# EAGLE design B+ to VM Protection Circuit (EAGLE 6.3)

## Sheet 1 of 5
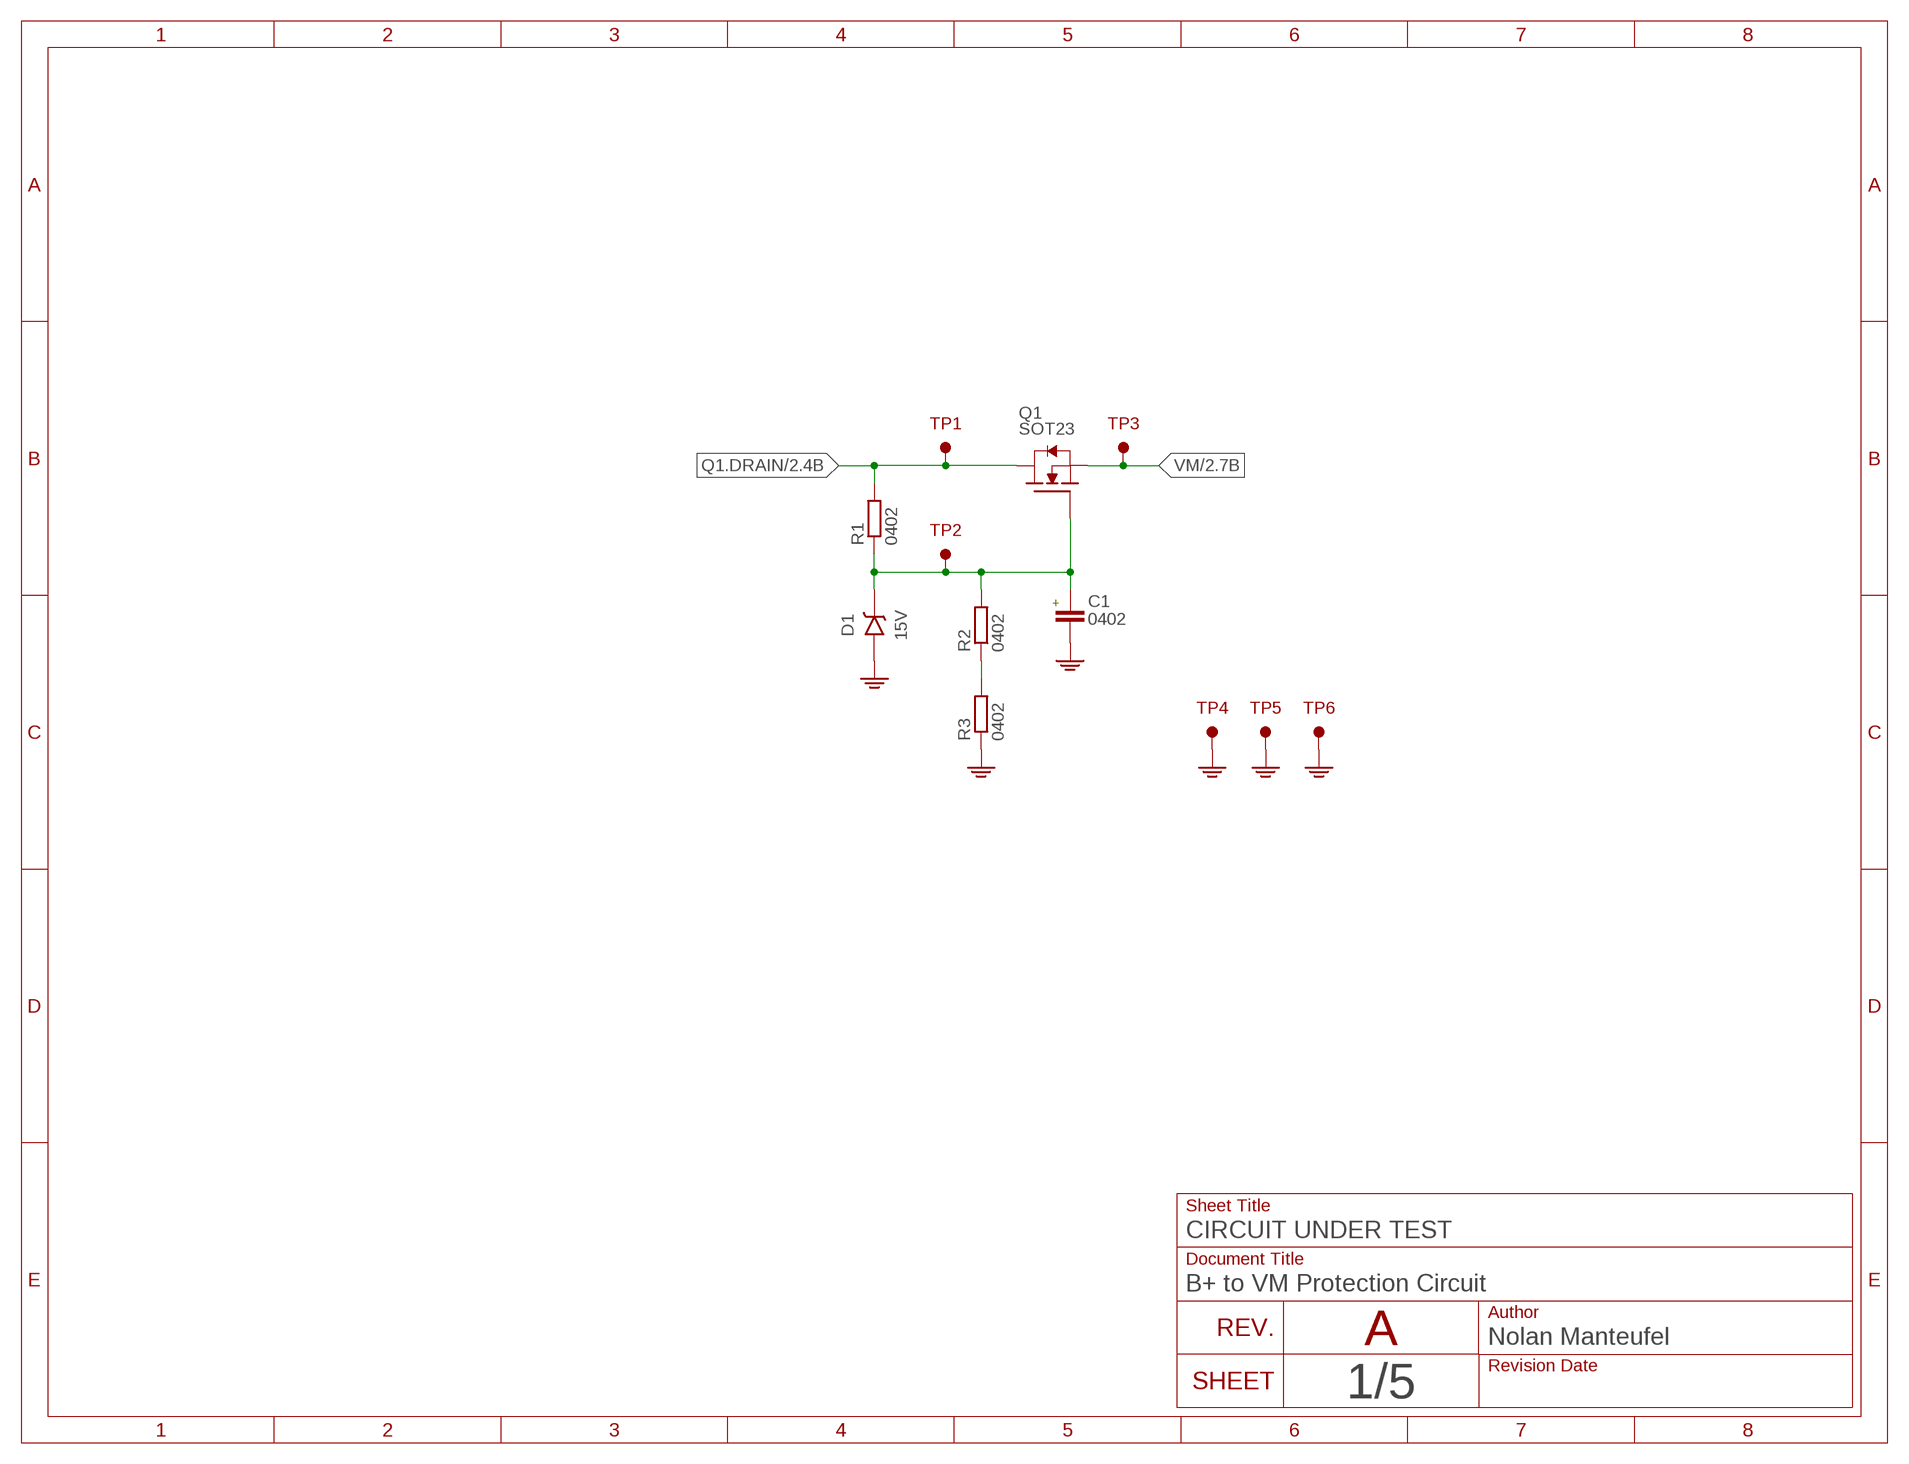
[diagram p0: schematic, sheet 1]

### Parts
C1  0402  C-EUC0402  [C0402]
D1  15V  ZENER-DIODESOT23  [SOT23]
Q1  SOT23  MOSFET-NSOT23  [SOT23]
R1  0402  R-EU_R0402  [R0402]
R2  0402  R-EU_R0402  [R0402]
R3  0402  R-EU_R0402  [R0402]
TP1  TESTPOINTKE5000-SMTEXT  [PINS_1_TESTPOINT_KE5000_NOTEXT]
TP2  TESTPOINTKE5000-SMTEXT  [PINS_1_TESTPOINT_KE5000_NOTEXT]
TP3  TESTPOINTKE5000-SMTEXT  [PINS_1_TESTPOINT_KE5000_NOTEXT]
TP4  TESTPOINTKE5000-SMTEXT  [PINS_1_TESTPOINT_KE5000_NOTEXT]
TP5  TESTPOINTKE5000-SMTEXT  [PINS_1_TESTPOINT_KE5000_NOTEXT]
TP6  TESTPOINTKE5000-SMTEXT  [PINS_1_TESTPOINT_KE5000_NOTEXT]

### Nets
GND: C1.2 D1.1(A) R3.1 TP4.1 TP5.1 TP6.1 ; also sheet 2,3,4,5
N$4: R2.1 R3.2
Q1.DRAIN: Q1.3(D) R1.2 TP1.1 ; also sheet 2
Q1.GATE: C1.1 D1.3(C) Q1.1(G) R1.1 R2.2 TP2.1
VM: Q1.2(S) TP3.1 ; also sheet 2,3

### Notes on the sheet
- A

## Sheet 2 of 5
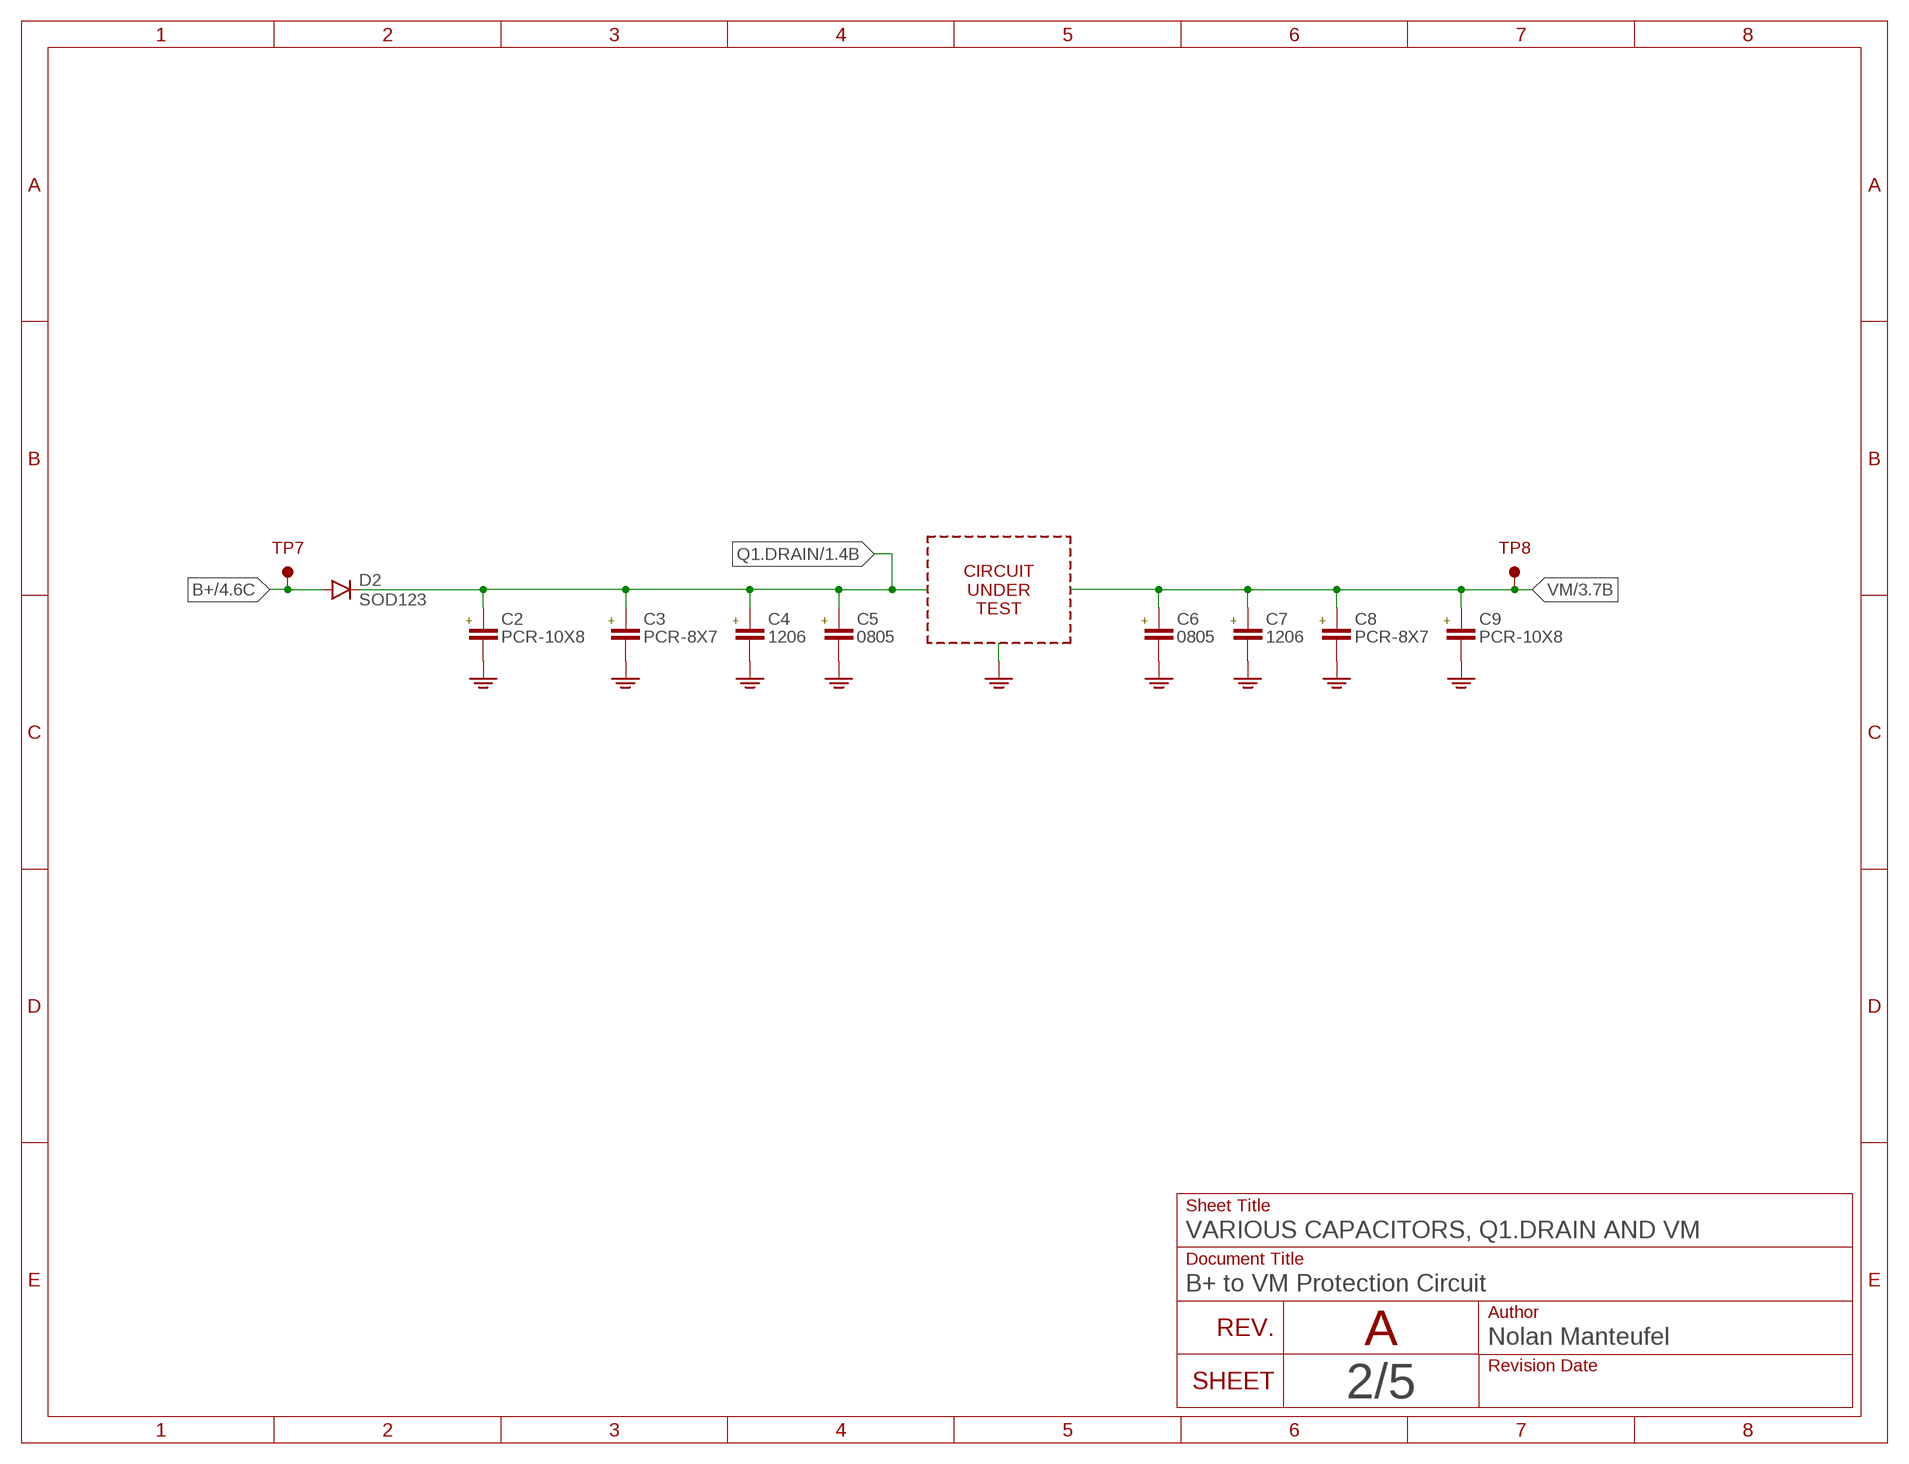
[diagram p1: schematic, sheet 2]

### Parts
C2  PCR-10X8  C-EUPCR-10X8  [C-PCR-10X8]
C3  PCR-8X7  C-EUPCR-8X7  [C-PCR-8X7]
C4  1206  C-EUC1206  [C1206]
C5  0805  C-EUC0805  [C0805]
C6  0805  C-EUC0805  [C0805]
C7  1206  C-EUC1206  [C1206]
C8  PCR-8X7  C-EUPCR-8X7  [C-PCR-8X7]
C9  PCR-10X8  C-EUPCR-10X8  [C-PCR-10X8]
D2  SOD123  DIODE-SOD123  [SOD123]
TP7  TESTPOINTKE5000-SMTEXT  [PINS_1_TESTPOINT_KE5000_NOTEXT]
TP8  TESTPOINTKE5000-SMTEXT  [PINS_1_TESTPOINT_KE5000_NOTEXT]

### Nets
B+: D2.A TP7.1 ; also sheet 4
GND: C2.- C3.- C4.- C5.2 C6.2 C7.- C8.- C9.- ; also sheet 1,3,4,5
Q1.DRAIN: C2.+ C3.+ C4.+ C5.1 D2.C ; also sheet 1
VM: C6.1 C7.+ C8.+ C9.+ TP8.1 ; also sheet 1,3

### Notes on the sheet
- CIRCUIT
  UNDER
  TEST
- A

## Sheet 3 of 5
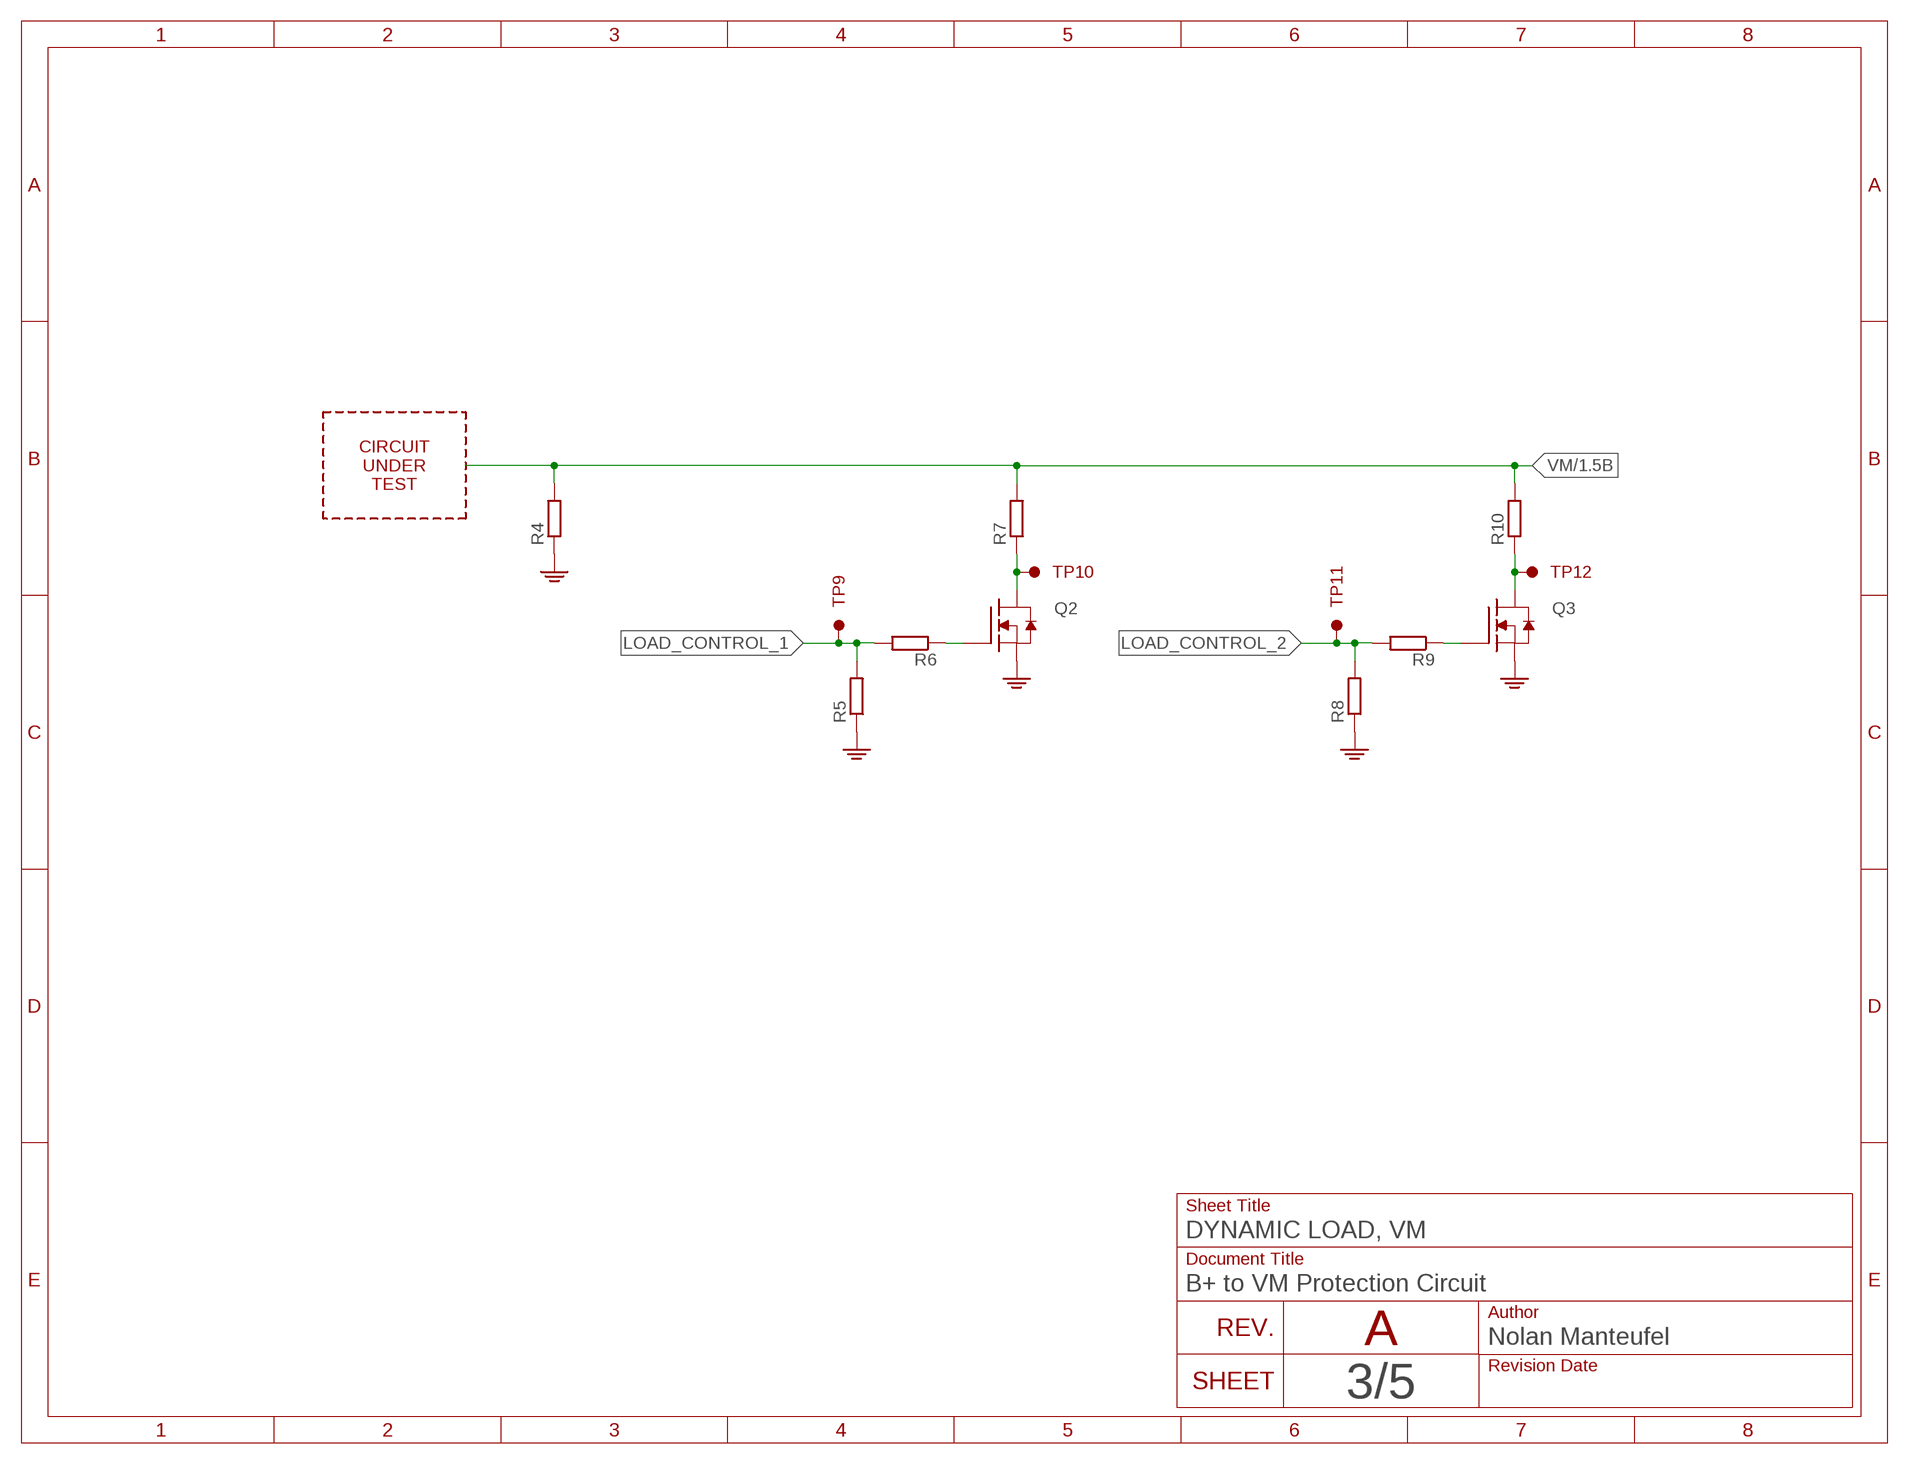
[diagram p2: schematic, sheet 3]

### Parts
Q2  MOSFET-N_NTMFS5C426NT3G  [DFN5]
Q3  MOSFET-N_NTMFS5C426NT3G  [DFN5]
R4  R-EU_0207/10  [0207/10]
R5  R-EU_M0805  [M0805]
R6  R-EU_M0805  [M0805]
R7  R-EU_0207/10  [0207/10]
R8  R-EU_M0805  [M0805]
R9  R-EU_M0805  [M0805]
R10  R-EU_0207/10  [0207/10]
TP9  TESTPOINTKE5000-SMTEXT  [PINS_1_TESTPOINT_KE5000_NOTEXT]
TP10  TESTPOINTKE5000-SMTEXT  [PINS_1_TESTPOINT_KE5000_NOTEXT]
TP11  TESTPOINTKE5000-SMTEXT  [PINS_1_TESTPOINT_KE5000_NOTEXT]
TP12  TESTPOINTKE5000-SMTEXT  [PINS_1_TESTPOINT_KE5000_NOTEXT]

### Nets
GND: Q2.1(S) Q2.2(S) Q2.3(S) Q3.1(S) Q3.2(S) Q3.3(S) R4.1 R5.1 R8.1 ; also sheet 1,2,4,5
LOAD_CONTROL_1: R5.2 R6.2 TP9.1
LOAD_CONTROL_2: R8.2 R9.2 TP11.1
N$2: Q2.5(D) R7.1 TP10.1
N$3: Q3.5(D) R10.1 TP12.1
N$5: Q3.4(G) R9.1
N$6: Q2.4(G) R6.1
VM: R4.2 R7.2 R10.2 ; also sheet 1,2

### Notes on the sheet
- CIRCUIT
  UNDER
  TEST
- A

## Sheet 4 of 5
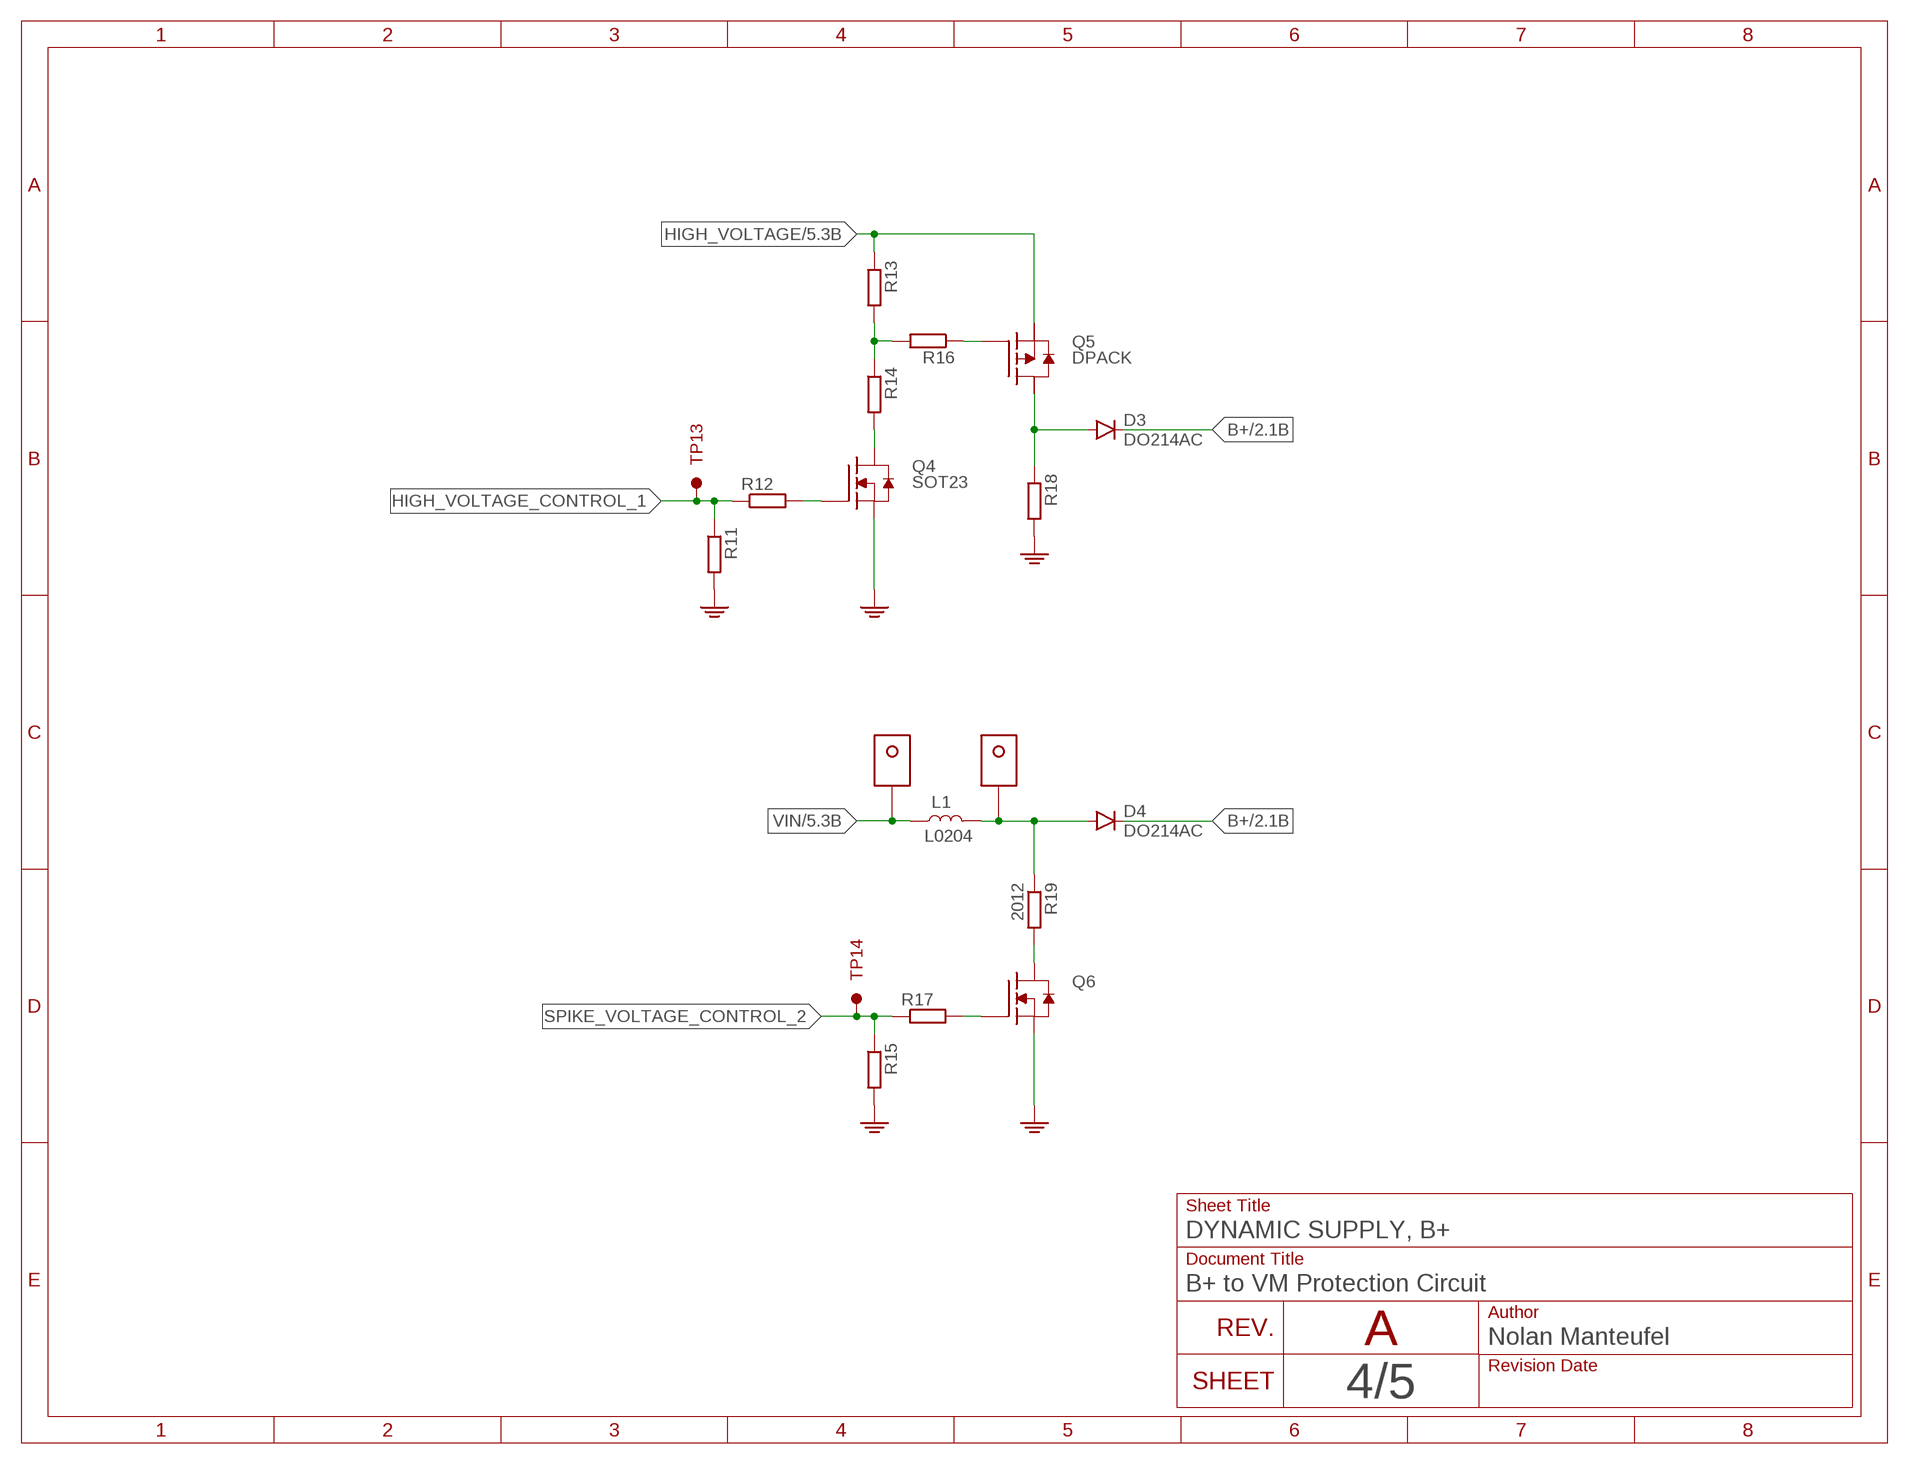
[diagram p3: schematic, sheet 4]

### Parts
D3  DO214AC  DIODE-DO214AC  [DO214AC]
D4  DO214AC  DIODE-DO214AC  [DO214AC]
L1  L0204  [0204/5]
Q4  SOT23  MOSFET-NSOT23  [SOT23]
Q5  DPACK  MOSFET-PDPAK  [D-PAK_TO252AA]
Q6  MOSFET-N_NTMFS5C426NT3G  [DFN5]
R11  R-EU_M0805  [M0805]
R12  R-EU_M0805  [M0805]
R13  R-EU_M0805  [M0805]
R14  R-EU_M0805  [M0805]
R15  R-EU_M0805  [M0805]
R16  R-EU_M0805  [M0805]
R17  R-EU_M0805  [M0805]
R18  R-EU_M0805  [M0805]
R19  2012  R-EU_R1210  [R1210]
TP13  TESTPOINTKE5000-SMTEXT  [PINS_1_TESTPOINT_KE5000_NOTEXT]
TP14  TESTPOINTKE5000-SMTEXT  [PINS_1_TESTPOINT_KE5000_NOTEXT]
U$1  SPADE-TAB  [SPADE-TAB-6.3MM]
U$2  SPADE-TAB  [SPADE-TAB-6.3MM]

### Nets
B+: D3.C D4.C ; also sheet 2
GND: Q4.2(S) Q6.1(S) Q6.2(S) Q6.3(S) R11.2 R15.2 R18.2 ; also sheet 1,2,3,5
HIGH_VOLTAGE: Q5.4(S) R13.1 ; also sheet 5
HIGH_VOLTAGE_CONTROL_1: R11.1 R12.1 TP13.1
N$7: R13.2 R14.1 R16.2
N$8: Q4.1(G) R12.2
N$9: Q4.3(D) R14.2
N$10: D3.A Q5.3(D) R18.1
N$11: Q6.4(G) R17.2
N$12: D4.A L1.2 R19.1 U$2.P$1 U$2.P$2
N$13: Q5.1(G) R16.1
N$14: Q6.5(D) R19.2
SPIKE_VOLTAGE_CONTROL_2: R15.1 R17.1 TP14.1
VIN: L1.1 U$1.P$1 U$1.P$2 ; also sheet 5

### Notes on the sheet
- A

## Sheet 5 of 5
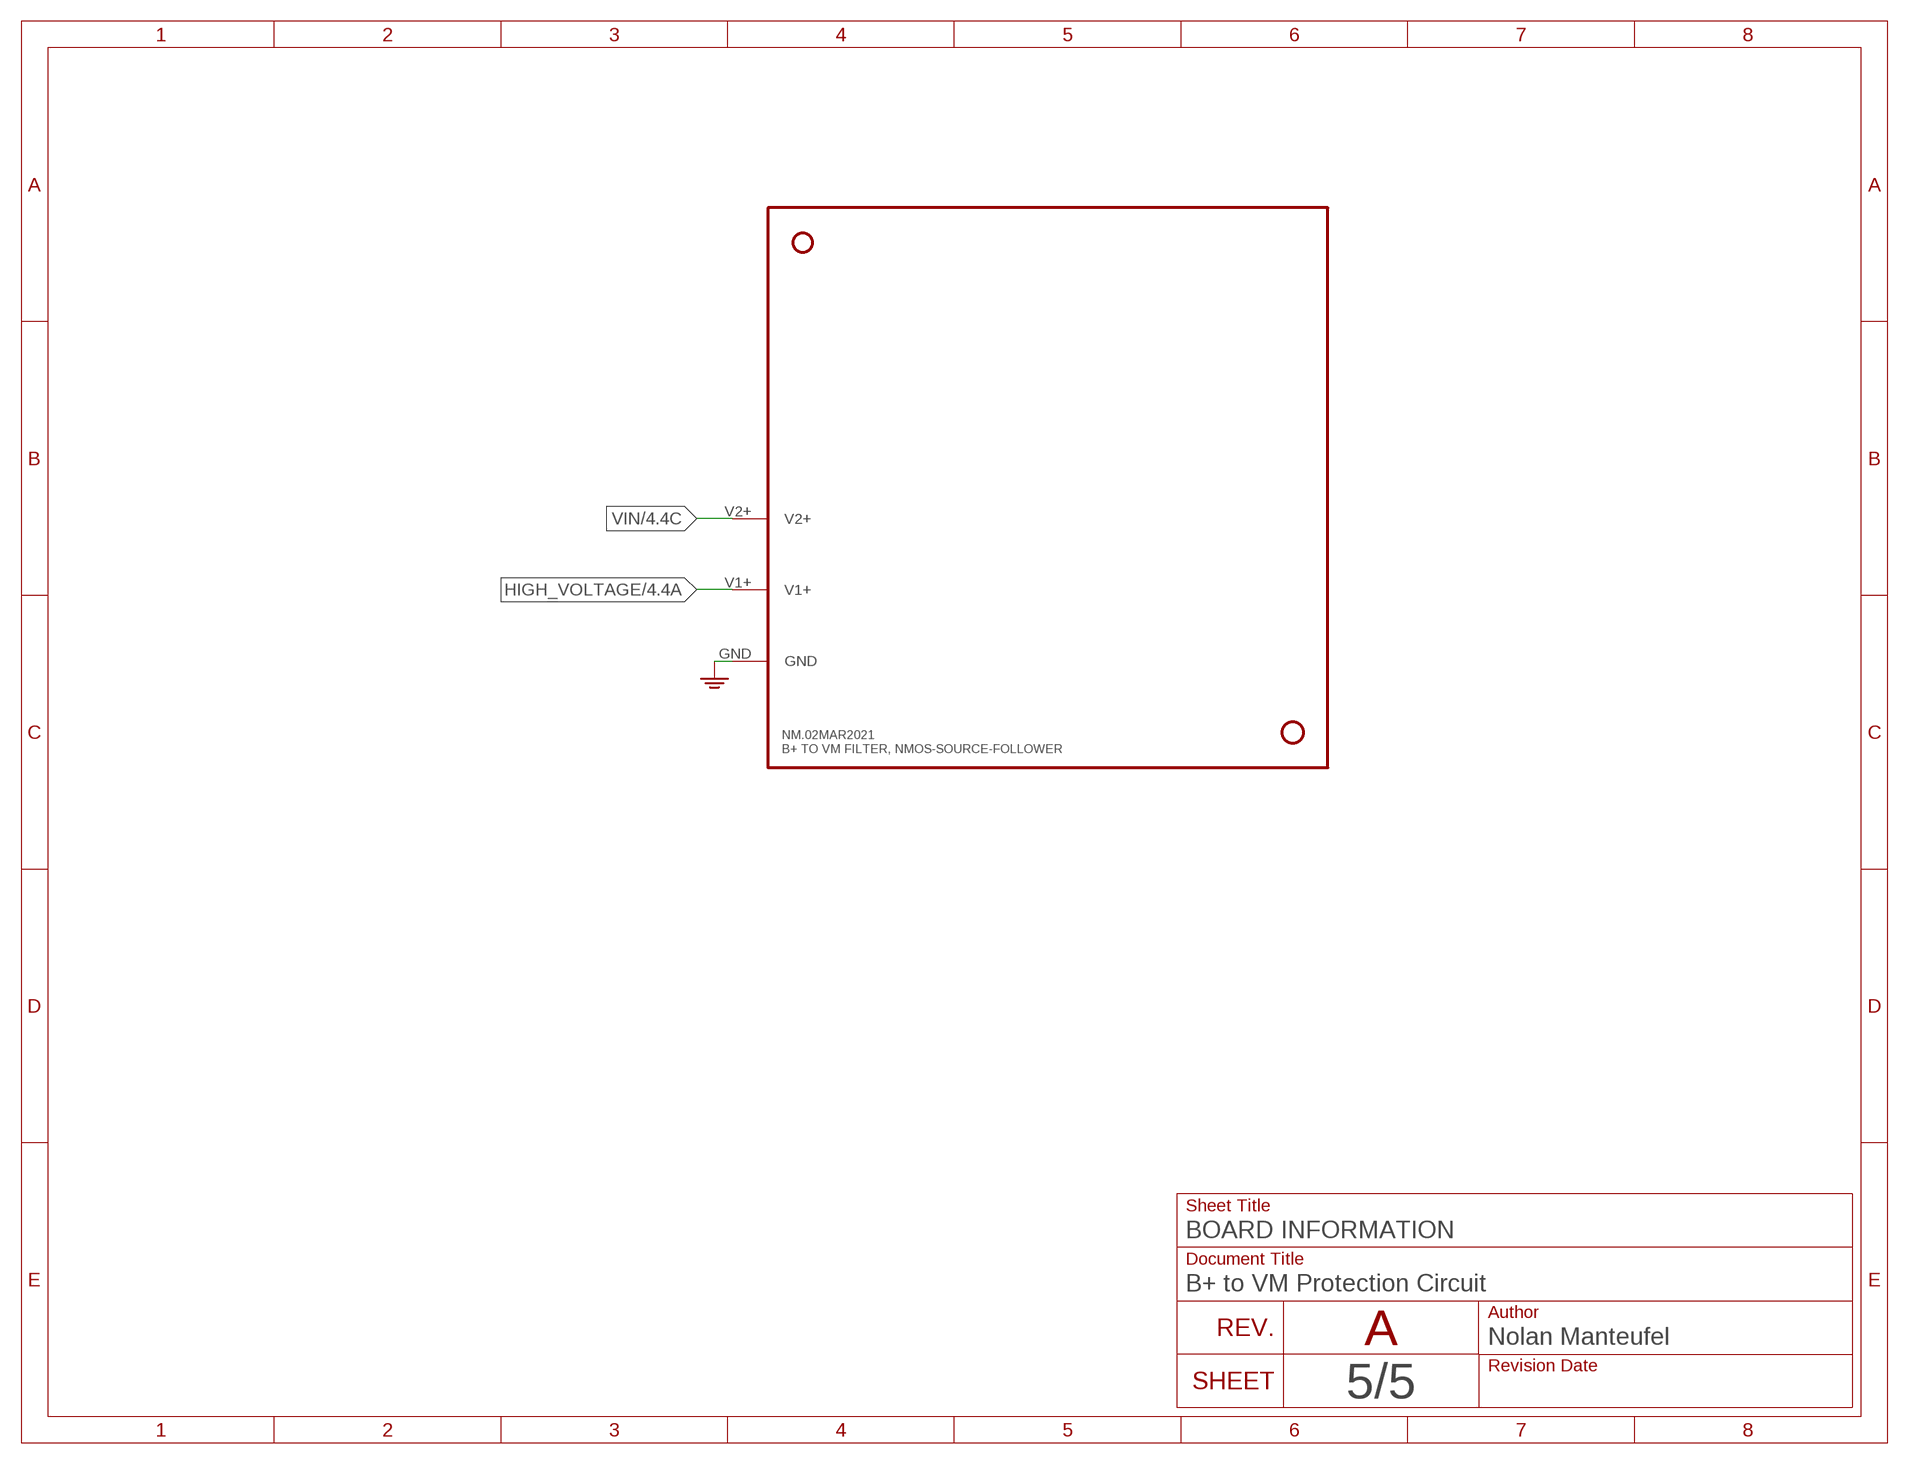
[diagram p4: schematic, sheet 5]

### Parts
NM.02MAR2021  B+ TO VM FILTER, NMOS-SOURCE-FOLLOWER  PCB_EVAL_80X80  [EVAL-80X80]

### Nets
GND: NM.02MAR2021.GND ; also sheet 1,2,3,4
HIGH_VOLTAGE: NM.02MAR2021.V1+ ; also sheet 4
VIN: NM.02MAR2021.V2+ ; also sheet 4

### Notes on the sheet
- A

## Library data of the parts
C1-C9 = nolan:C-EU: CAPACITOR, European symbol
D1 = nolan:ZENER-DIODE: Z-Diode
D2-D4 = nolan:DIODE-: DIODE
L1 = nolan:L
NM.02MAR2021 = nolan:PCB_EVAL_80X80
Q1-Q4 Q6 = nolan:MOSFET-N
Q5 = nolan:MOSFET-P
R1-R19 = nolan:R-EU_: RESISTOR, European symbol
TP1-TP14 = nolan:TESTPOINT
U$1 U$2 = nolan:SPADE-TAB

## Board
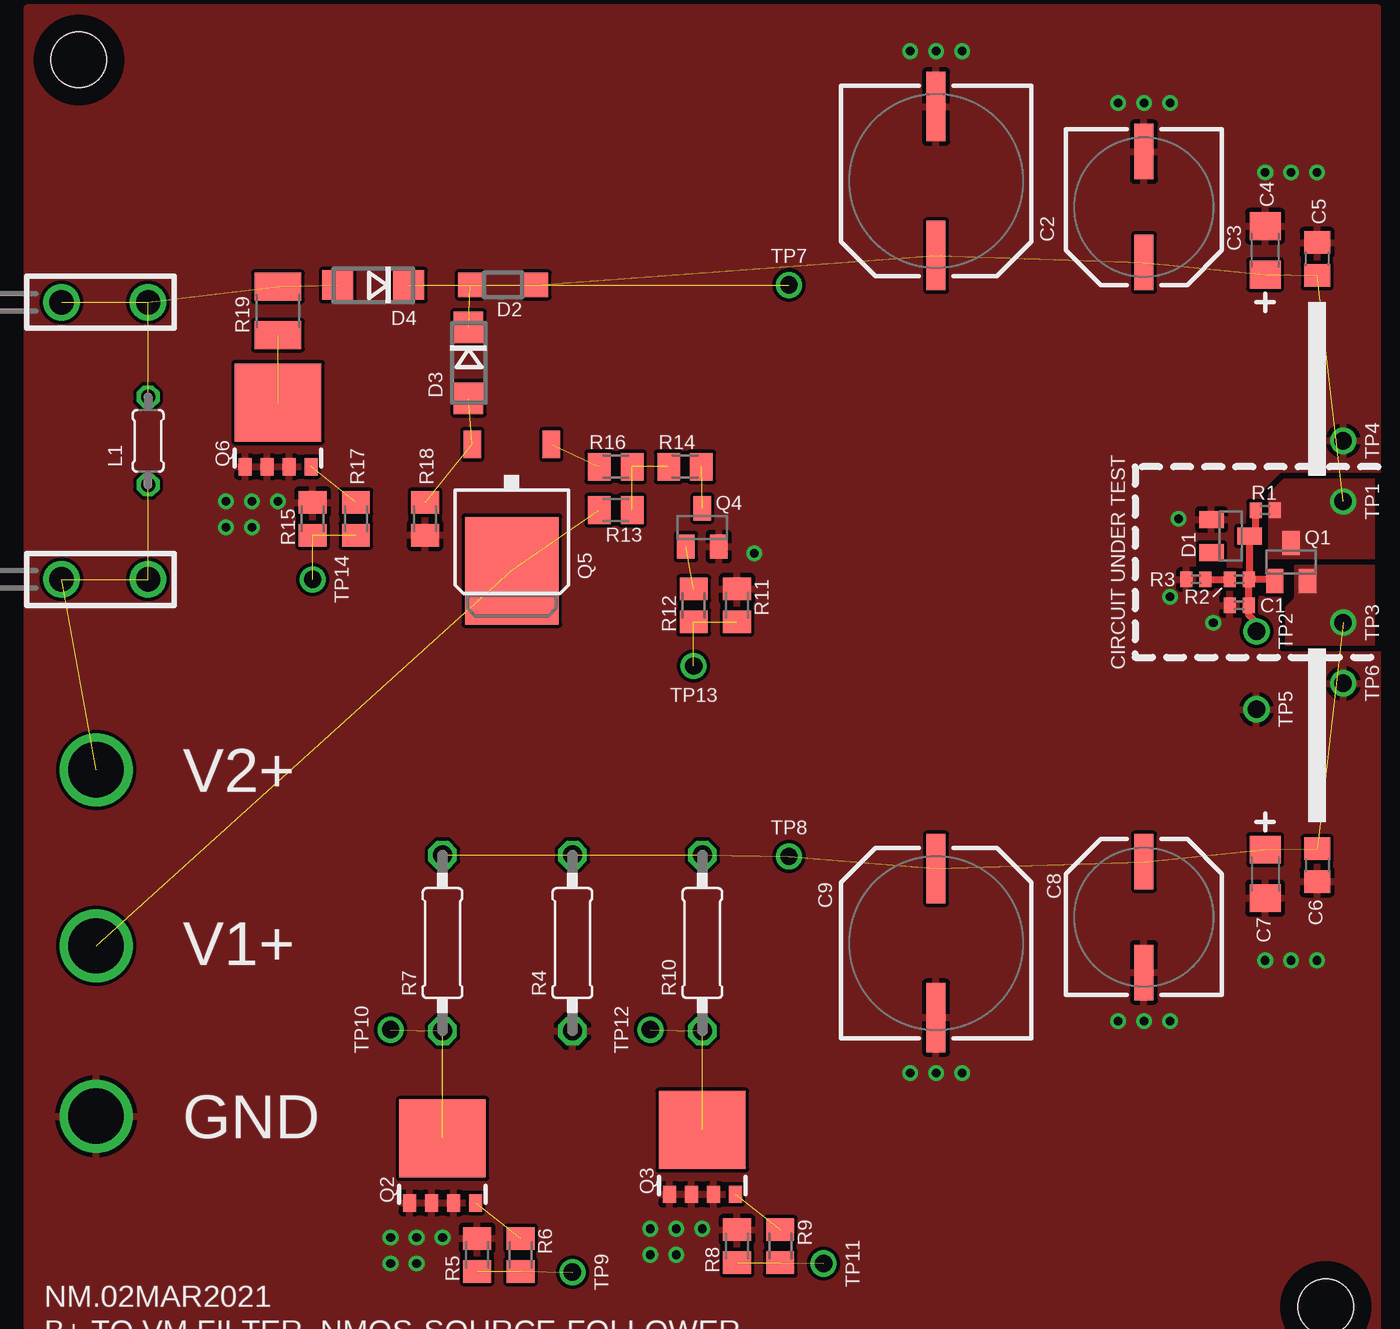
[diagram p5: board, top side]
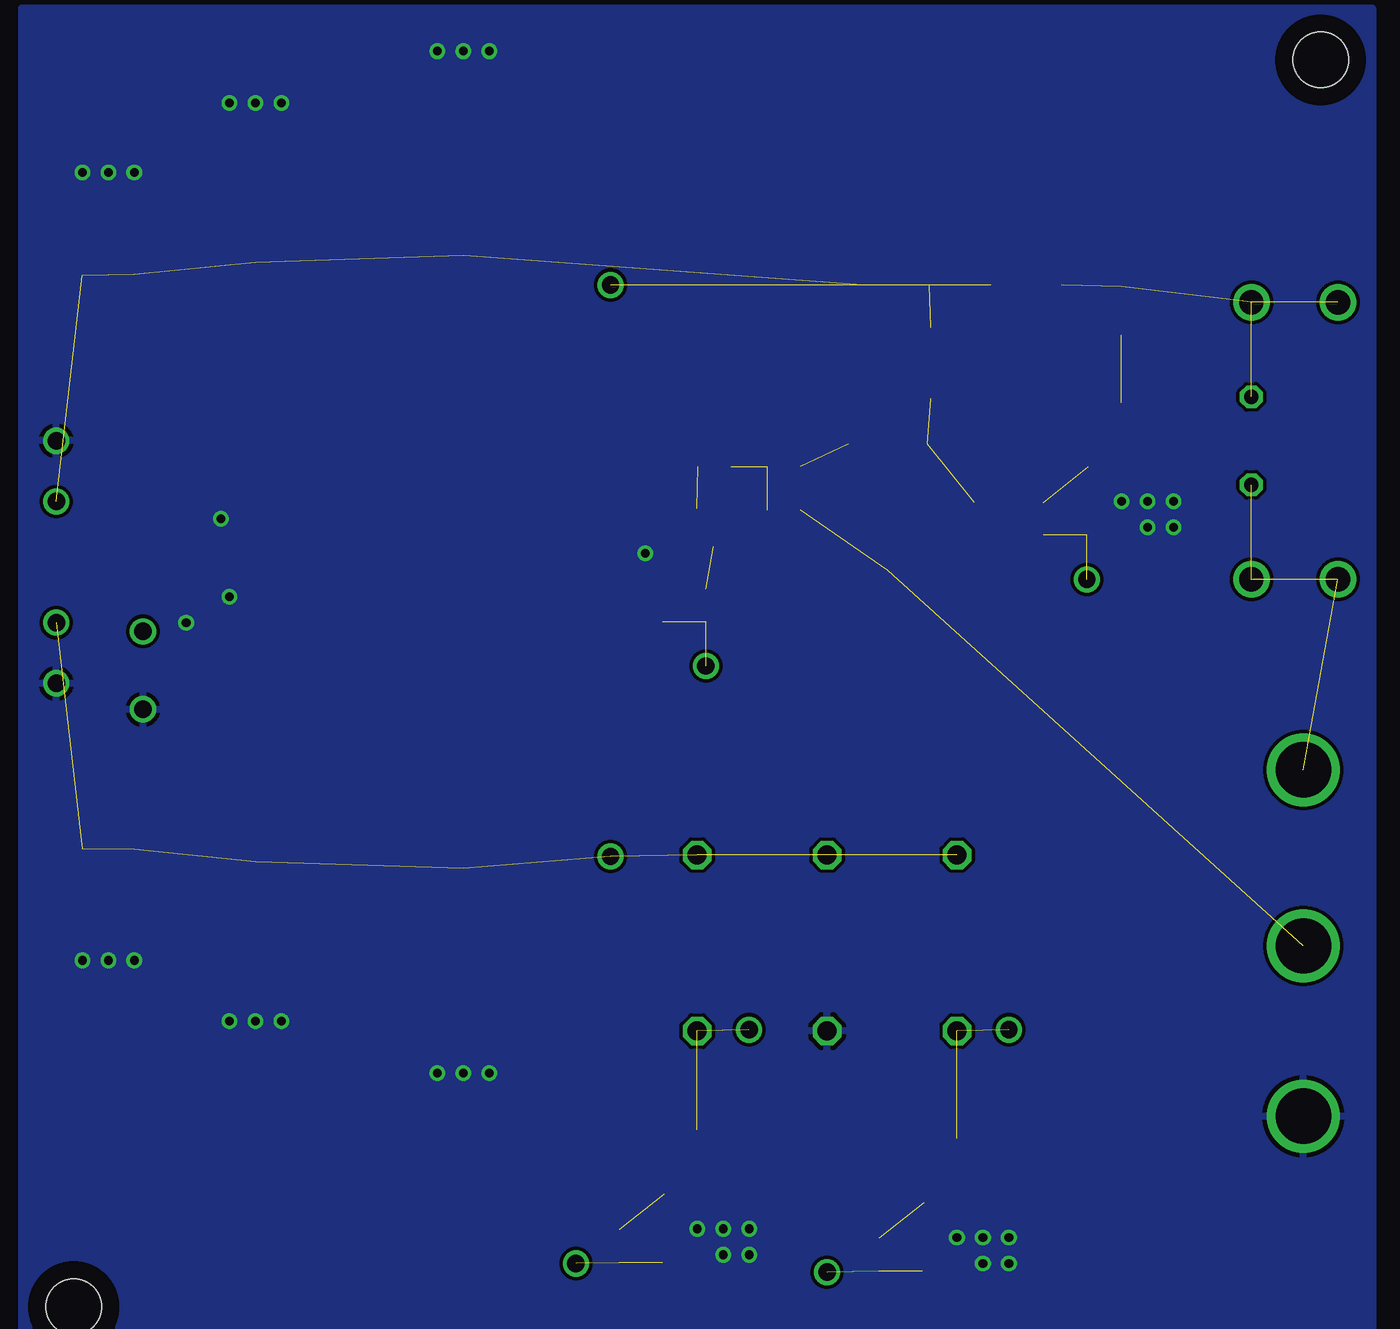
[diagram p6: board, bottom side, seen from below]

No outline drawn. Coordinates in mm, seen from the top.
Copper layers (1*16): Top 0.035mm / dielectric 1.5mm / Bottom 0.035mm
Design rules "default *": minimum track width 10mil, minimum drill 24mil, track to track 8mil, track to pad 8mil, pad to pad 8mil, via to via 8mil, smd to smd 8mil, copper to edge 40mil, drill to drill 8mil, minimum pad ring 10mil, minimum via ring 8mil, stop-mask expansion 4mil, vias tented up to drill 20mil, thermal gap 10mil
tRestrict: 11 lines

### Footprints (pad centres in the part's own frame; a part is rotated, then mirrored left to right if it is on the bottom)
C0402 = smd 0.7 x 0.9: 1 -0.55,0; 2 0.55,0
C-PCR-10X8 = smd 1.1 x 4: + 0,4.3; - 0,-4.3
C-PCR-8X7 = smd 1.1 x 3.2: + 0,3.2; - 0,-3.2
C1206 = smd 1.6 x 1.8: + -1.4,0; - 1.4,0
C0805 = smd 1.3 x 1.5: 1 -0.95,0; 2 0.95,0
SOT23 = smd 1 x 1.4: 1 -0.95,-1.1; 2 0.95,-1.1; 3 0,1.1
SOD123 = smd 1.4 x 1.4: A 1.9,0; C -1.9,0
DO214AC = smd 1.8 x 1.7: A 2.05,0; C -2.05,0
0204/5 = drill 0.813 octagon: 1 -2.54,0; 2 2.54,0
EVAL-80X80 = drill 3.2: GND 5,15; V1+ 5,24.84; V2+ 5,35 | hole 3.2: 4,76; 76,4
DFN5 = smd 0.75 x 1: 1 -1.905,-3; 2 -0.635,-3; 3 0.635,-3; 4 1.905,-3 | smd 5 x 4.5: 5 0,0.715
D-PAK_TO252AA = smd 1 x 1.6: 1 -2.28,-4.8; 3 2.28,-4.8 | smd 5.4 x 6.2: 4 0,2.5
R0402 = smd 0.7 x 0.9: 1 -0.55,0; 2 0.55,0
0207/10 = drill 1.1 octagon: 1 -5.08,0; 2 5.08,0
M0805 = smd 1.3 x 1.6: 1 -0.95,0; 2 0.95,0
R1210 = smd 1.6 x 2.7: 1 -1.4,0; 2 1.4,0
PINS_1_TESTPOINT_KE5000_NOTEXT = drill 1: 1 0,0
SPADE-TAB-6.3MM = drill 1.4: P$1 0,0; P$2 0,5

### Placement (x,y rotation side)
C1  71,44.5 180 top
C2  53.5,69 180 top
C3  65.5,67.5 180 top
C4  72.5,65 90 top
C5  75.5,64.5 90 top
C6  75.5,29.5 270 top
C7  72.5,29 270 top
C8  65.5,26.5 0 top
C9  53.5,25 0 top
D1  70.5,48.5 270 top
D2  28.5,63 180 top
D3  26.5,58.5 270 top
D4  21,63 180 top
L1  8,54 90 top
NM.02MAR2021  0,0 0 top
Q1  74,47 0 top
Q2  25,13 0 top
Q3  40,13.5 0 top
Q4  40,49 0 top
Q5  29,49 180 top
Q6  15.5,55.5 0 top
R1  72.5,50 0 top
R2  71,46 0 top
R3  68.5,46 0 top
R4  32.5,25 90 top
R5  27,7 270 top
R6  29.5,7 270 top
R7  25,25 90 top
R8  42,7.5 270 top
R9  44.5,7.5 270 top
R10  40,25 90 top
R11  42,44.5 90 top
R12  39.5,44.5 90 top
R13  35,50 0 top
R14  39,52.5 0 top
R15  17.5,49.5 90 top
R16  35,52.5 0 top
R17  20,49.5 90 top
R18  24,49.5 270 top
R19  15.5,61.5 270 top
TP1  77,50.5 270 top
TP2  72,43 270 top
TP3  77,43.5 270 top
TP4  77,54 270 top
TP5  72,38.5 270 top
TP6  77,40 270 top
TP7  45,63 0 top
TP8  45,30 0 top
TP9  32.5,6 270 top
TP10  22,20 90 top
TP11  47,6.5 270 top
TP12  37,20 90 top
TP13  39.5,41 180 top
TP14  17.5,46 270 top
U$1  3,46 270 top
U$2  3,62 270 top

### Tracks (layer width: path | path; a pad name or v marks a point on that pad's centre or on a via)
B+  (3 unrouted)
GND  (via drill 0.5)
  other vias: 12.5,50.5 14,50.5 15.5,50.5 14,49 12.5,49 43,47.5 25,8 23.5,8 22,8 22,6.5 23.5,6.5 40,8.5 38.5,8.5 37,8.5 37,7 38.5,7 55,17.5 53.5,17.5 52,17.5 67,20.5 65.5,20.5 64,20.5 75.5,24 74,24 72.5,24 55,76.5 53.5,76.5 52,76.5 67,73.5 65.5,73.5 64,73.5 75.5,69.5 74,69.5 72.5,69.5 67.5,49.5 67,45 69.5,43.5
  pour Top: 1,1 79,1 79,79 1,79
  pour Bottom: 1,1 79,1 79,79 1,79
HIGH_VOLTAGE  (2 unrouted)
HIGH_VOLTAGE_CONTROL_1  (2 unrouted)
LOAD_CONTROL_1  (2 unrouted)
LOAD_CONTROL_2  (2 unrouted)
N$2  (2 unrouted)
N$3  (2 unrouted)
N$4
  Top 0.406: R3.2 R2.1
N$5  (1 unrouted)
N$6  (1 unrouted)
N$7  (2 unrouted)
N$8  (1 unrouted)
N$9  (1 unrouted)
N$10  (2 unrouted)
N$11  (1 unrouted)
N$12  (4 unrouted)
N$13  (1 unrouted)
N$14  (1 unrouted)
Q1.DRAIN  (5 unrouted)
  pour Top (no thermals): 72.5,51 73.5,52 79,52 79,47 72.5,47
Q1.GATE
  Top 0.406: R2.2 C1.1 71.55,43.95 72,43.5 TP2.1 | Q1.1 72.95,46 R2.2 | R2.2 71.6,46.05 D1.3 71.95,48.85 R1.1
SPIKE_VOLTAGE_CONTROL_2  (2 unrouted)
VIN  (3 unrouted)
VM  (8 unrouted)
  pour Top (no thermals): 74,47 74,45 73.5,44.5 73.5,42 79,42 79,47

### Text on the board
tPlace: CIRCUIT UNDER TEST